# EAGLE design Fishbot_transmitter (EAGLE 8.5.0)
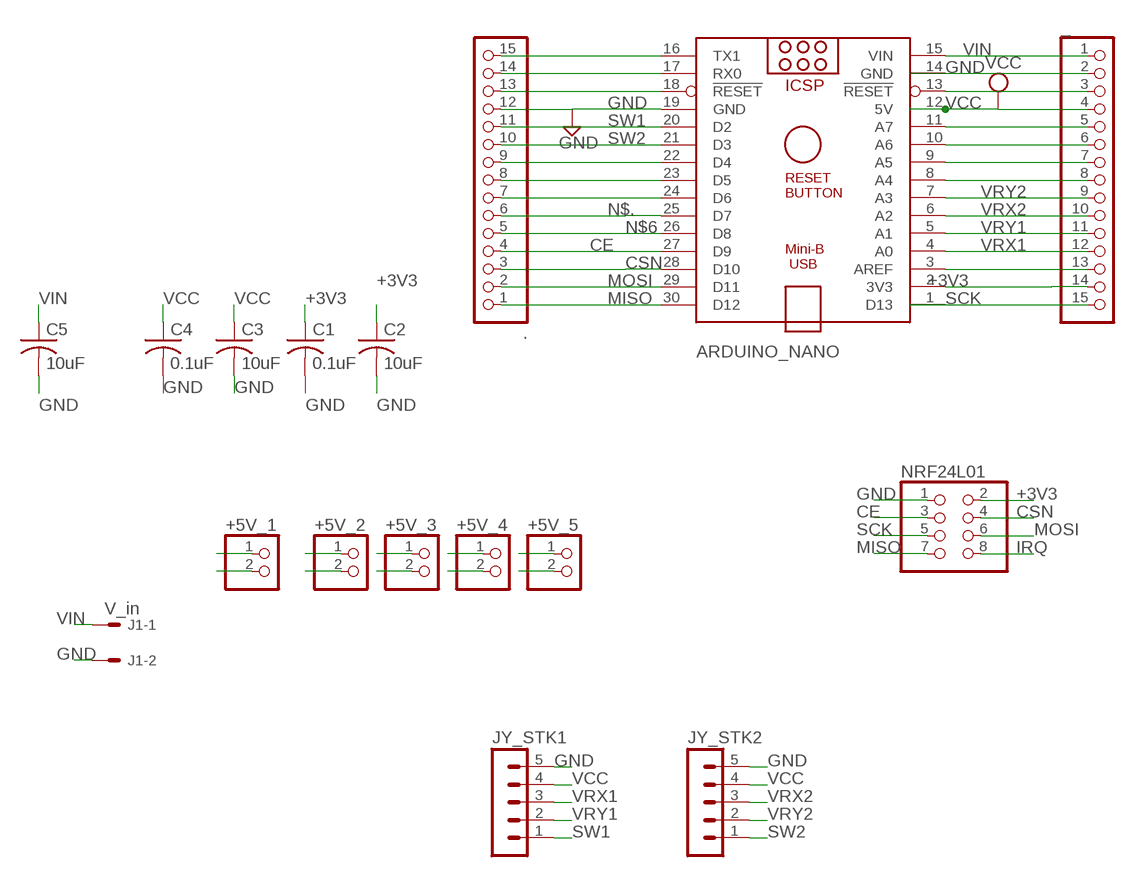
[diagram p0: schematic, sheet 1]

## Parts
+5V_1  PINHD-1X2  [1X02]
+5V_2  PINHD-1X2  [1X02]
+5V_3  PINHD-1X2  [1X02]
+5V_4  PINHD-1X2  [1X02]
+5V_5  PINHD-1X2  [1X02]
.  PINHD-1X15  [1X15]
_  PINHD-1X15  [1X15]
ARDUINO_NANO  ARDUINO_NANO  [ARDUINO_NANO]
C1  0.1uF  C-USC1206  [C1206]
C2  10uF  C-USC1206  [C1206]
C3  10uF  C-USC1206  [C1206]
C4  0.1uF  C-USC1206  [C1206]
C5  10uF  C-USC1206  [C1206]
J1  V_in  22-27-2021-02  [6410-02]
JY_STK1  MA05-1  [MA05-1]
JY_STK2  MA05-1  [MA05-1]
NRF24L01  PINHD-2X4  [2X04]

## Nets
+3V3: _.14 ARDUINO_NANO.2(3V3) C1.1 C2.1 NRF24L01.2
CE: ..4 ARDUINO_NANO.27(D9) NRF24L01.3
CSN: ..3 ARDUINO_NANO.28(D10) NRF24L01.4
GND: +5V_1.2 +5V_2.2 +5V_3.2 +5V_4.2 +5V_5.2 ..12 _.2 ARDUINO_NANO.14(GND) ARDUINO_NANO.19(GND) C1.2 C2.2 C3.2 C4.2 C5.2 J1.2 JY_STK1.5 JY_STK2.5 NRF24L01.1
IRQ: NRF24L01.8
MISO: ..1 ARDUINO_NANO.30(D12) NRF24L01.7
MOSI: ..2 ARDUINO_NANO.29(D11) NRF24L01.6
N$2: ..9 ARDUINO_NANO.22(D4)
N$3: ..8 ARDUINO_NANO.23(D5)
N$4: ..7 ARDUINO_NANO.24(D6)
N$6: ..5 ARDUINO_NANO.26(D8)
N$14: ..13 ARDUINO_NANO.18(!RESET)
N$15: ..14 ARDUINO_NANO.17(RX0)
N$16: ..15 ARDUINO_NANO.16(TX1)
N$19: _.3 ARDUINO_NANO.13(!RESET)
N$21: _.5 ARDUINO_NANO.11(A7)
N$22: _.6 ARDUINO_NANO.10(A6)
N$23: _.7 ARDUINO_NANO.9(A5)
N$24: _.8 ARDUINO_NANO.8(A4)
N$29: _.13 ARDUINO_NANO.3(AREF)
N$.: ..6 ARDUINO_NANO.25(D7)
SCK: _.15 ARDUINO_NANO.1(D13) NRF24L01.5
SW1: ..11 ARDUINO_NANO.20(D2) JY_STK1.1
SW2: ..10 ARDUINO_NANO.21(D3) JY_STK2.1
VCC: +5V_1.1 +5V_2.1 +5V_3.1 +5V_4.1 +5V_5.1 _.4 ARDUINO_NANO.12(5V) C3.1 C4.1 JY_STK1.4 JY_STK2.4
VIN: _.1 ARDUINO_NANO.15(VIN) C5.1 J1.1
VRX1: _.12 ARDUINO_NANO.4(A0) JY_STK1.3
VRX2: _.10 ARDUINO_NANO.6(A2) JY_STK2.3
VRY1: _.11 ARDUINO_NANO.5(A1) JY_STK1.2
VRY2: _.9 ARDUINO_NANO.7(A3) JY_STK2.2

## Library data of the parts
+5V_1-+5V_5 = pinhead:PINHD-1X2: PIN HEADER
. _ = pinhead:PINHD-1X15: PIN HEADER
ARDUINO_NANO = ArduinoNanoV30:ARDUINO_NANO: Arduino Nano V3.0 Overview: The Arduino Nano is a small, complete, and breadboard-friendly board based on the ATmega328 (Arduino Nano 3.x) or ATmega168 (Arduino Nano 2.x). It has more or less the same functionality of the Arduino Duemilanove, but in a different package. It lacks only a DC power jack, and works with a Mini-B USB cable instead of a standard one. The Nano was designed and is being produced by Gravitech. Specifications: Microcontroller Atmel ATmega168 or ATmega328 Operating Voltage (logic level) 5 V Input Voltage (recommended) 7-12 V Input Voltage (limits) 6-20 V Digital I/O Pins 14 (of which 6 provide PWM output) Analog Input Pins 8 DC Current per I/O Pin 40 mA Flash Memory 16 KB (ATmega168) or 32 KB (ATmega328) of which 2 KB used by bootloader SRAM 1 KB (ATmega168) or 2 KB (ATmega328) EEPROM 512 bytes (ATmega168) or 1 KB (ATmega328) Clock Speed 16 MHz Dimensions 0.73" x 1.70" Length 45 mm Width 18 mm Weigth 5 g Power: The Arduino Nano can be powered via the Mini-B USB connection, 6-20V unregulated external power supply (pin 30), or 5V regulated external power supply (pin 27). The power source is automatically selected to the highest voltage source. Memory: The ATmega168 has 16 KB of flash memory for storing code (of which 2 KB is used for the bootloader); the ATmega328 has 32 KB, (also with 2 KB used for the bootloader). The ATmega168 has 1 KB of SRAM and 512 bytes of EEPROM (which can be read and written with the EEPROM library); the ATmega328 has 2 KB of SRAM and 1 KB of EEPROM. Input and Output: Each of the 14 digital pins on the Nano can be used as an input or output, using pinMode(), digitalWrite(), and digitalRead() functions. They operate at 5 volts. Each pin can provide or receive a maximum of 40 mA and has an internal pull-up resistor (disconnected by default) of 20-50 kOhms. In addition, some pins have specialized functions. Visit Arduino - ArduinoBoardNano <https://www.arduino.cc/en/Main/ArduinoBoardNano>
C1-C5 = rcl:C-US: CAPACITOR, American symbol; SPICEPREFIX: C
J1 = con-molex:22-?-02: CONNECTOR wire to board 2.54 mm (.1 inch) pitch header; MF: MOLEX; OC_FARNELL: unknown; OC_NEWARK: unknown
JY_STK1 JY_STK2 = con-lstb:MA05-1: PIN HEADER; OC_FARNELL: unknown; OC_NEWARK: unknown
NRF24L01 = pinhead:PINHD-2X4: PIN HEADER

## Board
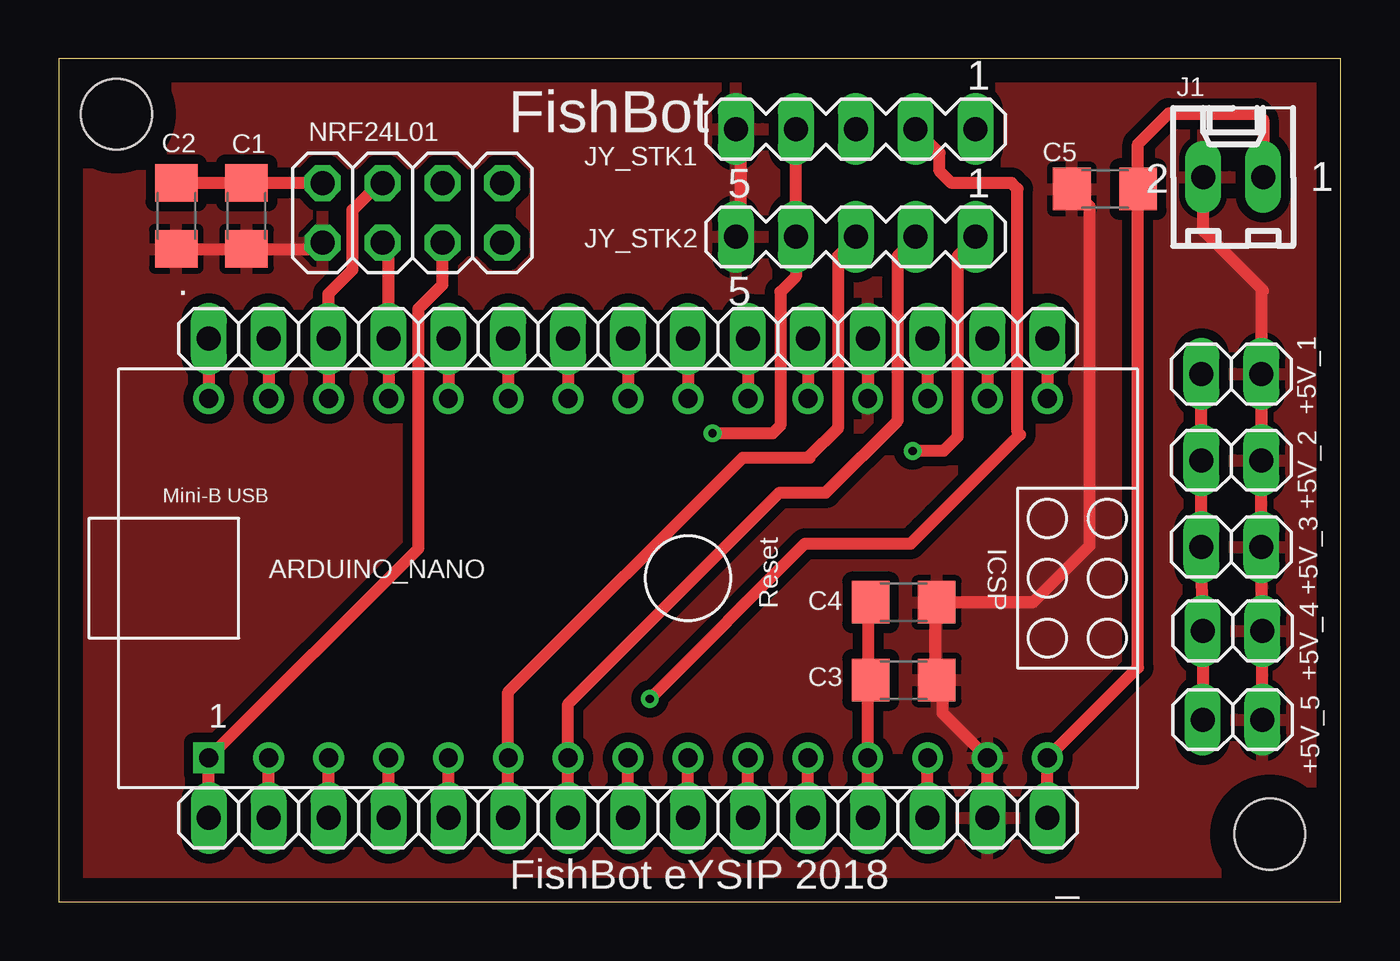
[diagram p1: board, top side]
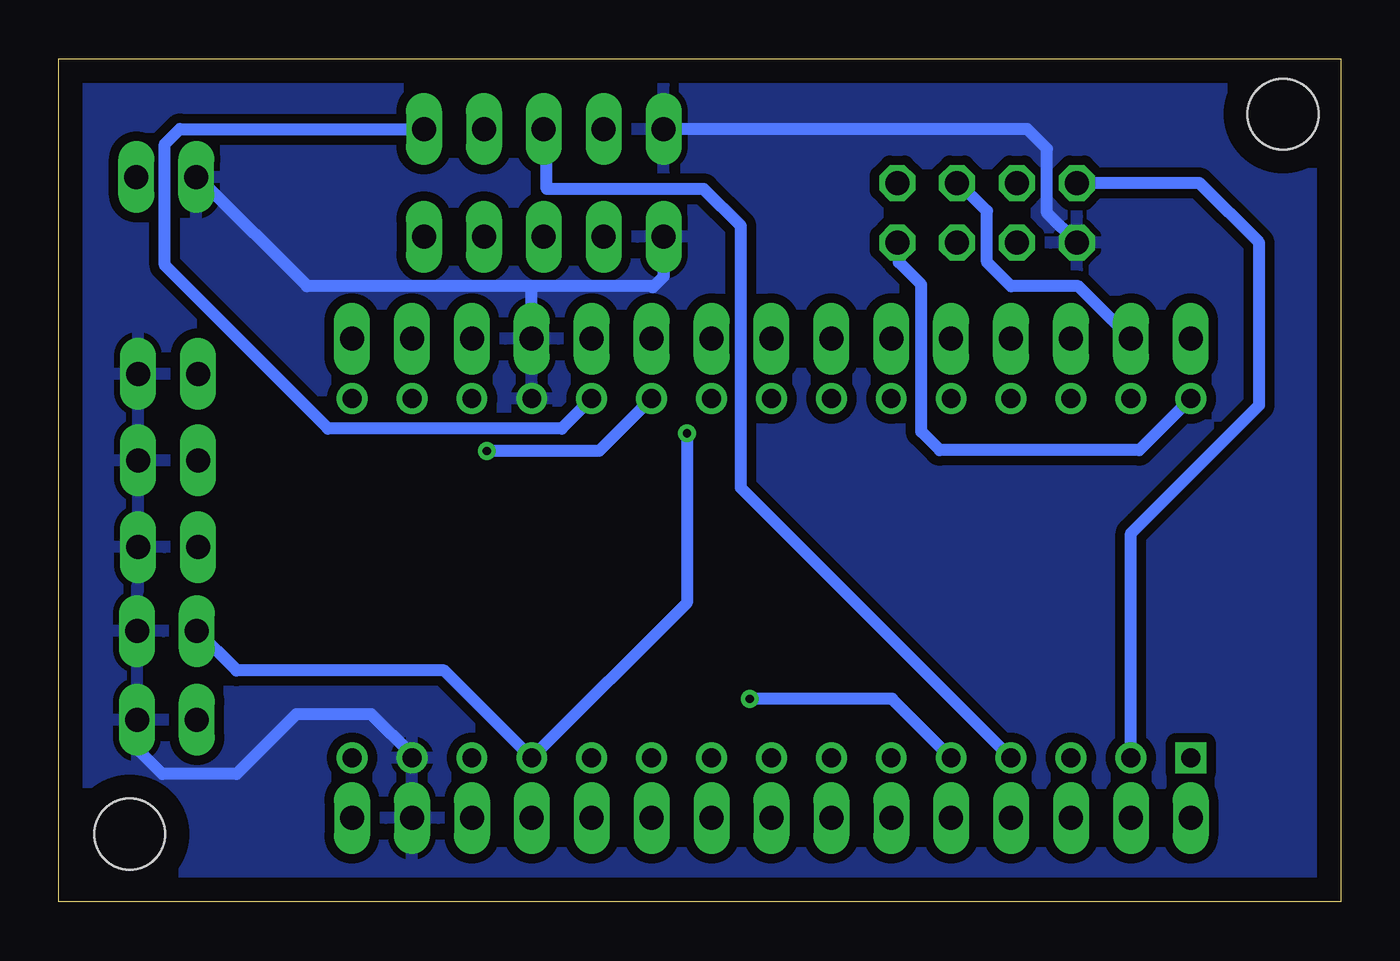
[diagram p2: board, bottom side, seen from below]

Size 54.34 x 35.74 mm. Coordinates in mm from the lower left corner, seen from the top.
Outline: 0,0 54.34,0 54.34,35.74 0,35.74 0,0
Copper layers (1*16): Top 0.035mm / dielectric 1.5mm / Bottom 0.035mm
Design rules "default *": minimum track width 20mil, minimum drill 0.35mm, track to track 16mil, track to pad 6mil, pad to pad 6mil, via to via 6mil, smd to smd 6mil, copper to edge 40mil, drill to drill 6mil, minimum pad ring 10mil, minimum via ring 8mil, stop-mask expansion 4mil, vias tented up to drill 0mil, thermal gap 10mil
Holes 3 mm at 2.44,33.4 51.33,2.87

### Footprints (pad centres in the part's own frame; a part is rotated, then mirrored left to right if it is on the bottom)
1X02 = drill 1.016 long: 1 -1.27,0; 2 1.27,0
1X15 = drill 1.016 long: 1 -17.78,0; 2 -15.24,0; 3 -12.7,0; 4 -10.16,0; 5 -7.62,0; 6 -5.08,0; 7 -2.54,0; 8 0,0; 9 2.54,0; 10 5.08,0; 11 7.62,0; 12 10.16,0; 13 12.7,0; 14 15.24,0; 15 17.78,0
ARDUINO_NANO = drill 0.8 square: 1 -20.32,-7.62 | drill 0.8: 2 -17.78,-7.62; 3 -15.24,-7.62; 4 -12.7,-7.62; 5 -10.16,-7.62; 6 -7.62,-7.62; 7 -5.08,-7.62; 8 -2.54,-7.62; 9 0,-7.62; 10 2.54,-7.62; 11 5.08,-7.62; 12 7.62,-7.62; 13 10.16,-7.62; 14 12.7,-7.62; 15 15.24,-7.62; 16 15.24,7.62; 17 12.7,7.62; 18 10.16,7.62; 19 7.62,7.62; 20 5.08,7.62; 21 2.54,7.62; 22 0,7.62; 23 -2.54,7.62; 24 -5.08,7.62; 25 -7.62,7.62; 26 -10.16,7.62; 27 -12.7,7.62; 28 -15.24,7.62; 29 -17.78,7.62; 30 -20.32,7.62
C1206 = smd 1.6 x 1.8: 1 -1.4,0; 2 1.4,0
6410-02 = drill 1.016 long: 1 1.27,0; 2 -1.27,0
MA05-1 = drill 1.016 long: 1 -5.08,0; 2 -2.54,0; 3 0,0; 4 2.54,0; 5 5.08,0
2X04 = drill 1.016 octagon: 1 -3.81,-1.27; 2 -3.81,1.27; 3 -1.27,-1.27; 4 -1.27,1.27; 5 1.27,-1.27; 6 1.27,1.27; 7 3.81,-1.27; 8 3.81,1.27

### Placement (x,y rotation side)
+5V_1  49.71,22.38 0 top
+5V_2  49.71,18.72 0 top
+5V_3  49.71,15.04 0 top
+5V_4  49.76,11.48 0 top
+5V_5  49.76,7.72 0 top
.  24.13,23.88 0 top
_  24.13,3.56 180 top
ARDUINO_NANO  26.67,13.72 0 top
C1  7.95,29.08 270 top
C2  4.98,29.08 270 top
C3  35.81,9.4 0 top
C4  35.81,12.7 0 top
C5  44.35,30.23 180 top
J1  49.78,30.73 0 top
JY_STK1  33.78,32.77 180 top
JY_STK2  33.78,28.19 180 top
NRF24L01  14.99,29.21 0 top

### Tracks (layer width: path | path; a pad name or v marks a point on that pad's centre or on a via)
+3V3
  Top 0.508: _.14 ARDUINO_NANO.2 | 11.11,30.54 NRF24L01.2 C1.1 C2.1
  Bottom 0.508: ARDUINO_NANO.2 8.89,15.62 3.45,21.06 3.45,27.94 5.99,30.48 NRF24L01.2
CE
  Top 0.508: ARDUINO_NANO.27 ..4 13.97,27.69 NRF24L01.3
CSN
  Top 0.508: ARDUINO_NANO.28 ..3 11.43,25.78 12.45,26.8 12.45,29.34 13.59,30.48 NRF24L01.4
GND
  Top 0.508: _.2 ARDUINO_NANO.14 37.47,8 37.47,9.27 C3.2 37.15,9.59 37.15,12.45 C4.2 41.3,12.7 43.69,15.09 43.69,29.49 C5.2 | ..12 ARDUINO_NANO.19 | 28.89,31.81 28.89,32.77 JY_STK1.5 28.89,31.81 | 28.89,31.81 28.89,28.32 JY_STK2.5 | J1.2 48.51,28.45 51.05,25.91 50.98,25.83 +5V_1.2 +5V_2.2 +5V_3.2 +5V_4.2 +5V_5.2 | C2.2 C1.2 10.92,27.68 NRF24L01.1
  Bottom 0.508: J1.2 48.26,30.54 43.81,26.1 34.31,26.1 | _.2 39.37,2.29 | JY_STK2.5 28.7,26.52 29.16,26.06 29.2,26.1 34.31,26.1 | ..12 34.29,26.07 34.31,26.1 | ARDUINO_NANO.14 39.37,6.22 41.1,7.95 44.27,7.95 46.81,5.41 49.96,5.41 51.03,6.48 +5V_5.2 | NRF24L01.1 12.45,29.21 12.45,31.93 13.28,32.77 JY_STK1.5
  pour Top (isolate 0.406): 0.56,35.28 54,35.28 54,0.41 0.56,0.41
  pour Bottom (isolate 0.406): 0.58,35.33 54,35.33 54,0.3 0.58,0.3
MISO
  Top 0.508: ..1 ARDUINO_NANO.30
  Bottom 0.508: NRF24L01.7 18.73,27.69 18.73,27.11 17.78,26.16 17.78,19.94 16.99,19.15 8.53,19.15 ARDUINO_NANO.30
MOSI
  Top 0.508: ..2 ARDUINO_NANO.29
  Bottom 0.508: ..2 11.11,26.1 13.97,26.1 14.99,27.11 14.99,29.29 16.18,30.48 NRF24L01.6
N$2
  Top 0.508: ..9 ARDUINO_NANO.22
N$3
  Top 0.508: ..8 ARDUINO_NANO.23
N$4
  Top 0.508: ..7 ARDUINO_NANO.24
N$6
  Top 0.508: ..5 ARDUINO_NANO.26
N$14
  Top 0.508: ..13 ARDUINO_NANO.18
N$15
  Top 0.508: ..14 ARDUINO_NANO.17
N$16
  Top 0.508: ..15 ARDUINO_NANO.16
N$19
  Top 0.508: _.3 ARDUINO_NANO.13
N$21
  Top 0.508: _.5 ARDUINO_NANO.11
N$22
  Top 0.508: _.6 ARDUINO_NANO.10
N$23
  Top 0.508: _.7 ARDUINO_NANO.9
N$24
  Top 0.508: _.8 ARDUINO_NANO.8
N$29
  Top 0.508: _.13 ARDUINO_NANO.3
N$.
  Top 0.508: ..6 ARDUINO_NANO.25
SCK
  Top 0.508: _.15 ARDUINO_NANO.1 15.24,14.99 15.24,25.15 16.26,26.16 NRF24L01.5
SW1
  Top 0.508: ..11 ARDUINO_NANO.20
  Bottom 0.508: JY_STK1.1 49.21,32.77 49.85,32.13 49.85,26.99 42.93,20.07 33.02,20.07 ARDUINO_NANO.20
SW2  (via drill 0.35)
  Top 0.508: ..10 ARDUINO_NANO.21 | JY_STK2.1 38.73,28 38.1,27.37 38.1,19.71 37.5,19.11 v36.2,19.11
  Bottom 0.508: v36.2,19.11 31.43,19.11 ARDUINO_NANO.21
VCC  (via drill 0.35)
  Top 0.508: C4.1 34.29,12.45 34.29,9.59 C3.1 34.29,9.27 ARDUINO_NANO.12 _.4 | +5V_1.1 +5V_2.1 +5V_3.1 +5V_4.1 +5V_5.1 | JY_STK1.4 JY_STK2.4 31.24,26.52 30.58,25.86 30.58,20.19 30.25,19.86 v27.71,19.86
  Bottom 0.508: +5V_4.1 46.81,9.8 38,9.8 ARDUINO_NANO.12 27.71,12.68 v27.71,19.86
VIN
  Top 0.508: _.1 ARDUINO_NANO.15 45.75,9.93 C5.1 45.75,32.13 47.04,33.43 50.8,33.43 51.05,33.17 J1.1
VRX1
  Top 0.508: _.12 ARDUINO_NANO.4
  Bottom 0.508: JY_STK1.3 33.66,32.77 33.66,30.23 27,30.23 25.43,28.65 25.43,17.55 ARDUINO_NANO.4
VRX2
  Top 0.508: _.10 ARDUINO_NANO.6 19.05,8.89 28.98,18.82 31.83,18.82 31.83,18.87 33.02,20.07 33.02,27.37 33.66,28 JY_STK2.3
VRY1  (via drill 0.35)
  Top 0.508: _.11 ARDUINO_NANO.5 | JY_STK1.2 37.34,31.75 37.34,30.99 37.85,30.48 40.39,30.48 40.64,30.23 40.64,19.91 40.74,19.81 36.11,15.18 31.63,15.18 v25.05,8.6
  Bottom 0.508: ARDUINO_NANO.5 19.02,8.6 v25.05,8.6
VRY2
  Top 0.508: _.9 ARDUINO_NANO.7 21.59,8.38 30.56,17.35 32.5,17.35 35.56,20.41 35.56,27.37 36.2,28 JY_STK2.2

### Text on the board
tNames: FishBot | FishBot eYSIP 2018